# Altium project bitirme_yeni.PrjPcb
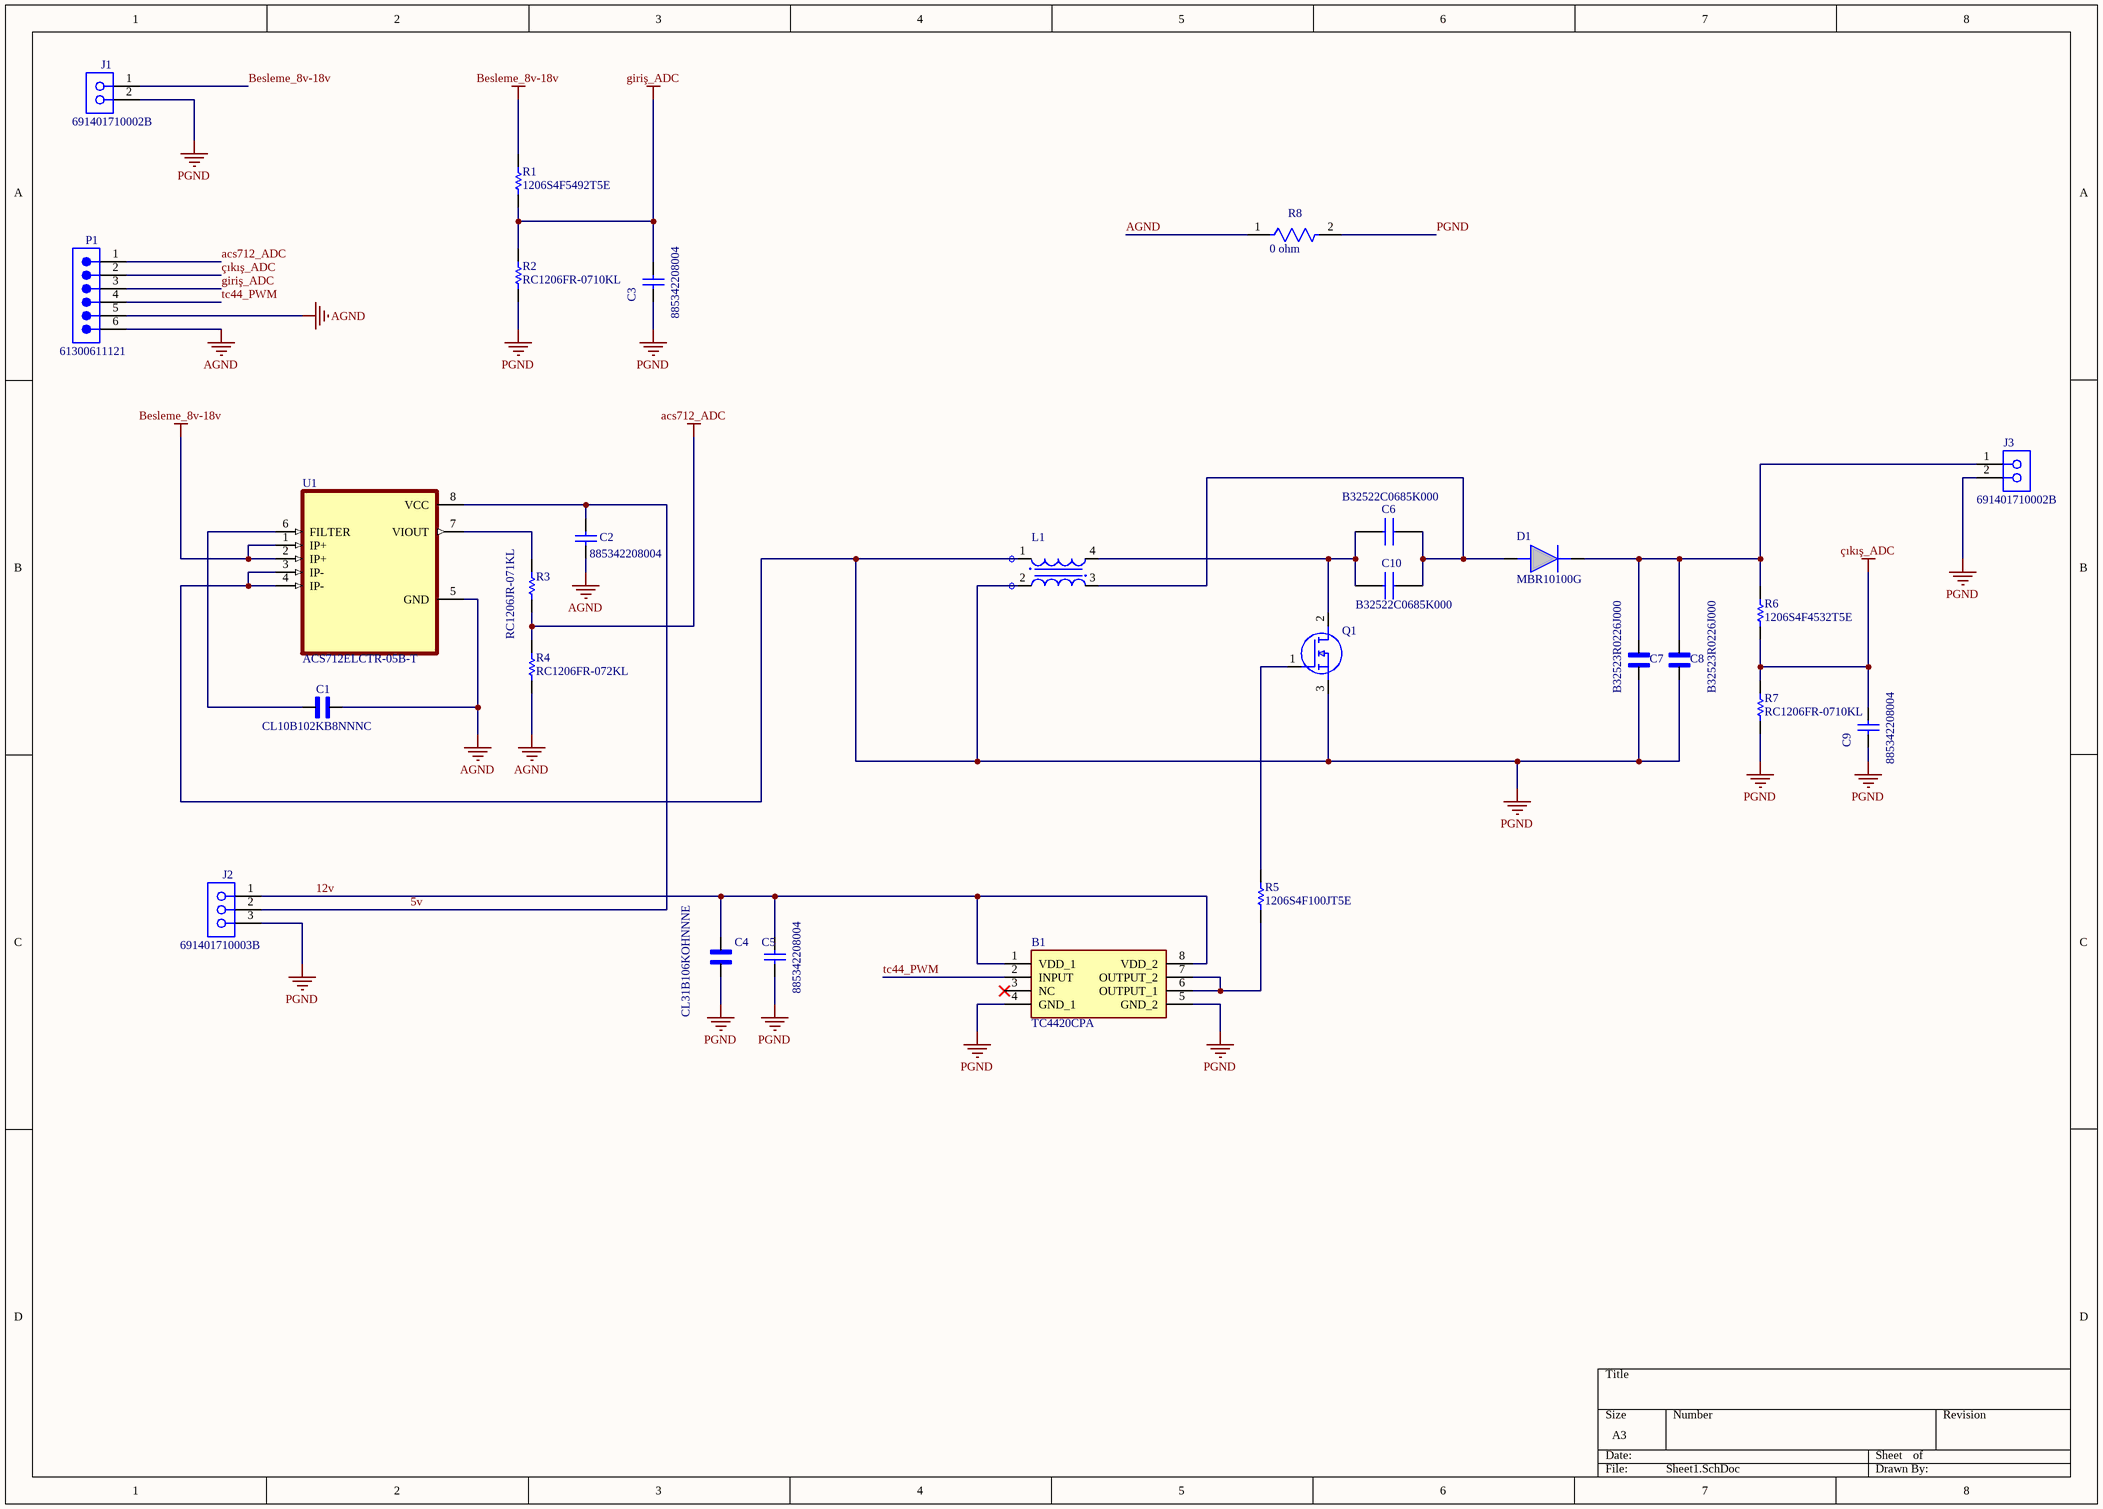
[diagram p0: Sheet1.SchDoc]
1 sheet, 27 parts. Net scope: global (net labels, ports and power ports of the same name join across sheets).
Board file: PCB1.PcbDoc

## Sheet Sheet1.SchDoc
size A3; SheetNumber: 1; SheetTotal: 1

### Parts
B1  TC4420CPA  [DIP794W56P254L946H432Q8N]
C1  CL10B102KB8NNNC  [CAPC1608X90N]
C2  885342208004  [WCAP-CSMH_1206_H1.6]
C3  885342208004  [WCAP-CSMH_1206_H1.6]
C4  CL31B106KOHNNNE  [CAPC3216X180N]
C5  885342208004  [WCAP-CSMH_1206_H1.6]
C6  B32522C0685K000  [B32522C0685K000]
C7  B32523R0226J000  [CAPRR2250W80L2650T1200H2200]
C8  B32523R0226J000  [CAPRR2250W80L2650T1200H2200]
C9  885342208004  [WCAP-CSMH_1206_H1.6]
C10  B32522C0685K000  [B32522C0685K000]
D1  MBR10100G  [TO508P997X444X1905-2]
J1  691401710002B  [691401710002B]
J2  691401710003B  [691401710003B]
J3  691401710002B  [691401710002B]
L1  WE-CFWI_1312  [caupled ınductor]  (value not drawn)
P1  61300611121  [61300611121]
Q1  IXTP110N055T2 hortizol  [TO254P1054X470X1955-3]  (value not drawn)
R1  1206S4F5492T5E  [RESC3116X65X40ML10T20]
R2  RC1206FR-0710KL  [RESC3116X65X40ML10T20]
R3  RC1206JR-071KL  [RESC3116X65X40ML10T20]
R4  RC1206FR-072KL  [RESC3116X65X40ML10T20]
R5  1206S4F100JT5E  [RESC3116X65X40ML10T20]
R6  1206S4F4532T5E  [RESC3116X65X40ML10T20]
R7  RC1206FR-0710KL  [RESC3116X65X40ML10T20]
R8  0 ohm  [FP-RT0805-MFG]
U1  ACS712ELCTR-05B-T  [SOIC127P600X175-8N]

### Nets
acs712_ADC: P1.1 R3.1 R4.2
AGND: C1.2 C2.1 P1.5 P1.6 R4.1 R8.1 U1.5(GND)
Besleme_8v-18v: J1.1 R1.2 U1.1(IP+) U1.2(IP+)
giriş_ADC: C3.2 P1.3 R1.1 R2.2
PGND: B1.4(GND_1) B1.5(GND_2) C3.1 C4.1 C5.1 C7.1 C8.1 C9.1 J1.2 J2.3 J3.2 L1.1 L1.2 Q1.3(S) R2.1 R7.1 R8.2 U1.3(IP-) U1.4(IP-)
çıkış_ADC: C9.2 P1.2 R6.1 R7.2
5v: C2.2 J2.2 U1.8(VCC)
12v: B1.1(VDD_1) B1.8(VDD_2) C4.2 C5.2 J2.1
tc44_PWM: B1.2(INPUT) P1.4
NetB1_6: B1.6(OUTPUT_1) B1.7(OUTPUT_2) R5.1
NetC1_1: C1.1 U1.6(FILTER)
NetC6_1: C6.1 C10.1 L1.4 Q1.2(D)
NetC6_2: C6.2 C10.2 D1.3(A) L1.3
NetC7_2: C7.2 C8.2 D1.1(K) J3.1 R6.2
NetQ1_1: Q1.1(G) R5.2
NetR3_2: R3.2 U1.7(VIOUT)

Not connected (* = marked no-connect by the designer): B1 3(NC)*

### Library data of the parts
B1 = TC4420CPA: Microchip TC4420CPA, MOSFET Power Driver 6A, 4.5  18 V, Non-Inverting, 8-Pin PDIP; Geometry.Height: 4.32mm; Manufacturer_Name: Microchip; Manufacturer_Part_Number: TC4420CPA; Mouser Part Number: 579-TC4420CPA; Mouser Price/Stock: https://www.mouser.co.uk/ProductDetail/Microchip-Technology/TC4420CPA?qs=iwvYsH9bSFa1PGvH4l1FjA%3D%3D; Arrow Part Number: TC4420CPA; Arrow Price/Stock: https://www.arrow.com/en/products/tc4420cpa_1/microchip-technology.html?utm_currency=USD&region=europe; Datasheet Link: http://uk.rs-online.com/web/p/products/6811124P
C1 = CL10B102KB8NNNC: MF: {'manufacturer': u'Samsung Electro-Mechanics'}; Package: None; Price: None; Value: *; MP: CL10B102KB8NNNC; Availability: Unavailable
C2 C3 C5 C9 = CMP-03913-89205750-2: 0.1μF ±10% 250V Ceramic Capacitor X7R 1206 (3216 Metric); Insulation Resistance: 1GΩ; Capacitance: 100nF; Max Operating Temperature: 125°C; Voltage Rating (DC): 250V; Length: 3.2mm; Min Operating Temperature: -55°C; Voltage Rating: 250V; Dielectric: X7R; RoHS: Compliant; Width: 1.6mm; Height: 1.6mm
C4 = CL31B106KOHNNNE: 10 ÂµF Â±10% 16V Ceramic Capacitor X7R 1206 (3216 Metric); MF: Samsung; SnapEDA_Link: https://www.snapeda.com/parts/CL31B106KOHNNNE/Samsung/view-part/?ref=snap; Package: SMD-2 Samsung; Value: *; MP: CL31B106KOHNNNE; Check_prices: https://www.snapeda.com/parts/CL31B106KOHNNNE/Samsung/view-part/?ref=eda
C6 C10 = B32522C0685K000: Metallized Polyester Capacitors (MKT), 6.8uF, 63V DC, 8.5mm(W) x 14.5mm(H) x 18mm(L); Manufacturer_Name: TDK; Manufacturer_Part_Number: B32522C0685K000; Mouser Part Number: 871-B32522C685K; Mouser Price/Stock: https://www.mouser.co.uk/ProductDetail/EPCOS-TDK/B32522C0685K000?qs=Xovllr2ZOuapE0m0FCy1CA%3D%3D; Arrow Part Number: B32522C0685K000; Arrow Price/Stock: https://www.arrow.com/en/products/b32522c0685k000/epcos-tdk; Datasheet Link: https://product.tdk.com/system/files/dam/doc/product/capacitor/film/mkt/data_sheet/20/20/db/fc_2009/b32520_529.pdf; Geometry.Height: 14.5mm
C7 C8 = B32523R0226J000: 22 ÂµF Film Capacitor 40V 63V Polyester, Polyethylene Terephthalate (PET), Metallized - Stacked Radial; MF: TDK; SnapEDA_Link: https://www.snapeda.com/parts/B32523R0226J000/TDK/view-part/?ref=snap; Package: NON-STANDARD-2 TDK; Value: *; MP: B32523R0226J000; Check_prices: https://www.snapeda.com/parts/B32523R0226J000/TDK/view-part/?ref=eda
D1 = MBR10100G: Low Forward Voltage; Lead Temperature for Soldering Purposes: 260 C Max. for 10 Seconds; Low Power Loss/High Efficiency; Epoxy Meets UL94, VO at 1/8; 150 C Operating Junction Temperature; Case: Epoxy, Molded; Low Stored Charge Majority Carrier Conduction Mechanical Characteristics:; Weight: 1.9 grams (approximately); High Surge Capacity; Guard-Ring for Stress Protection; Finish: All External Surfaces Corrosion Resistant and Terminal Leads are Readily Solderable; AEC-Q101 Qualified and PPAP Capable; NRVB P; Manufacturer_Name: onsemi; Geometry.Height: 4.82mm; Manufacturer_Part_Number: MBR10100G; Mouser Part Number: 863-MBR10100G; Mouser Price/Stock: https://www.mouser.co.uk/ProductDetail/onsemi/MBR10100G?qs=3JMERSakebrmlzTWRmdCeA%3D%3D; Arrow Part Number: MBR10100G; Arrow Price/Stock: https://www.arrow.com/en/products/mbr10100g/on-semiconductor?utm_currency=USD&region=europe; Datasheet Link: https://www.onsemi.com/pub/Collateral/MBR1080-D.PDF
J1 J3 = CMP-1502-03003-3: Terminal Block, 5.00MM Screwless Horizontal, 2.0MM 2 Wires, 14-24 AWG, 2 Pin; Voltage Rating: 300V; Current Rating: 10A; Number of Contacts: 2; RoHS: Compliant; Contact Material: Tin; Number of Rows: 1; Height: 13.5mm; Max Operating Temperature: 105°C; Min Operating Temperature: -40°C
J2 = CMP-1502-03004-3: Terminal Block, 5.00MM Screwless Horizontal, 2.0MM 2 Wires, 14-24 AWG, 3 Pin
L1 = WE-CFWI_1312: MF: {'manufacturer': u'W\xfcrth Elektronik'}; MP: 74485540101; Package: None; Price: None; Value: *; Availability: Unavailable
P1 = CMP-1502-01070-4: THT Vertical Pin Header WR-PHD, Pitch 2.54 mm, Single Row, 6 pins; Pitch: 2.54mm; Operating Supply Voltage: 250V; Connector Type: Male Pin; Gender: Male; Number of Positions: 6; Contact Resistance: 20mΩ; Current Rating: 3A; Termination: Through Hole; Color: Black; Number of Pins: 6; Lead Pitch: 2.54mm; Height: 8.89mm; RoHS: Compliant; Lead Free: Lead Free; Contact Mating Length: 5.9944mm; Contact Plating: Gold; Contact Gender: Male; Packaging: Bulk; Orientation: Vertical; Mount: Through Hole; Voltage Rating: 250V; Number of Rows: 1; Max Operating Temperature: 105°C; Min Operating Temperature: -40°C; Housing Material: PBT; Contact Material: Gold; Number of Contacts: 6
Q1 = LM7805CT/NOPB: MF: {'manufacturer': u'Texas Instruments'}; Package: None; Price: None; Value: *; MP: LM7805CT/NOPB; Availability: Unavailable
R1-R3 R6 R7 = RC1206FR-0710KL: Chip Resistor, 10 KOhm, +/- 1%, 0.25 W, -55 to 155 degC, 1206 (3216 Metric), RoHS, Tape and Reel; Manufacturer: Yageo; Voltage Rating: 200V; Resistance: 10KOhm; Temperature Coefficient: 100ppm/degreesC; Power Rating: 250mW; Packaging: TapeandReel; Termination: SMD/SMT; REACH SVHC: Unknown; Tolerance: 1%; Height: 0.55mm; Composition: ThickFilm; Max Operating Temperature: 155degC; Datasheet Version: Rev. 5, 10/2016; Lead Free: LeadFree; Case Code (Metric): 3216; Depth: 1.6mm; Package Quantity: 5000; RoHSCompliant: true; Military Standard: Not; Case/Package: 1206; Case Code (Imperial): 1206; Min Operating Temperature: -55degC; Datasheet URL: http://www.yageo.com/NewPortal/yageodocoutput?fileName=/pdf/R-Chip/PYu-RC_Group_51_RoHS_L_5.pdf; Length: 3.1mm; Manufacturer URL: http://www.yageo.com/; Package Reference: 1206.0; Width: 1.6mm; Package Description: 2-Pin Surface Mount Device, Body 3.1 x 1.6 mm
R4 = RC1206FR-072KL: Manufacturer: Yageo; Part Number: RC1206FR-101K21L
R5 = RC1206FR-0736KL: Chip Resistor, 10 KOhm, +/- 1%, 0.25 W, -55 to 155 degC, 1206 (3216 Metric), RoHS, Tape and Reel; Manufacturer: Yageo; Voltage Rating: 200V; Resistance: 10KOhm; Temperature Coefficient: 100ppm/degreesC; Power Rating: 250mW; Packaging: TapeandReel; Termination: SMD/SMT; REACH SVHC: Unknown; Tolerance: 1%; Height: 0.55mm; Composition: ThickFilm; Max Operating Temperature: 155degC; Datasheet Version: Rev. 5, 10/2016; Lead Free: LeadFree; Case Code (Metric): 3216; Depth: 1.6mm; Package Quantity: 5000; RoHSCompliant: true; Military Standard: Not; Case/Package: 1206; Case Code (Imperial): 1206; Min Operating Temperature: -55degC; Datasheet URL: http://www.yageo.com/NewPortal/yageodocoutput?fileName=/pdf/R-Chip/PYu-RC_Group_51_RoHS_L_5.pdf; Length: 3.1mm; Manufacturer URL: http://www.yageo.com/; Package Reference: 1206.0; Width: 1.6mm; Package Description: 2-Pin Surface Mount Device, Body 3.1 x 1.6 mm
R8 = 0 ohm: RES SMD 681 OHM 0.1% 1/8W 0805; Manufacturer: Yageo; Manufacturer Part Number: RT0805BRD07681RL; Value: 681Ω; Temperature Coefficient: 25 ppm/°C; Power Rating: 0.125W; Voltage Rating: 150V; Tolerance: 0.0025; ComponentLink2URL: http://www.yageo.com/documents/recent/PYu-RT_1-to-0.01_RoHS_L_9.pdf; Ipc Land Pattern Name: RESC200125X50; Footprint Url: http://www.yageo.com/exep/pages/download/literatures/PYu-R_Mount_10.pdf; Temperature: -55°C to +155°C; Resistance: 681Ω; Mouser Description: Thin Film Resistors - SMD 1/8W 681 ohm .1% 25ppm; Temperature Range High: +155°C; Device Class L3: Chip SMD Resistors; Automotive: No; Octopart: https://octopart.com/rt0805brd07681rl-yageo-1270194; Device Class L1: Passive Components; Package: RT0805; Device Class L2: Resistors; Category: Res; RoHS: TRUE; Composition: Thin Film; ComponentLink2Description: Datasheet; Temperature Range Low: -55°C; Lead Free: Yes; Digikey Description: RES SMD 681 OHM 0.1% 1/8W 0805; Height: 0.6mm; Series: RT
U1 = ACS712ELCTR-05B-T: MF: {'manufacturer': u'Allegro MicroSystems'}; Package: None; Price: None; Value: *; MP: ACS712ELCTR-05B-T; Availability: Unavailable